# Altium project BMS_MAINBOARD.PrjPCB
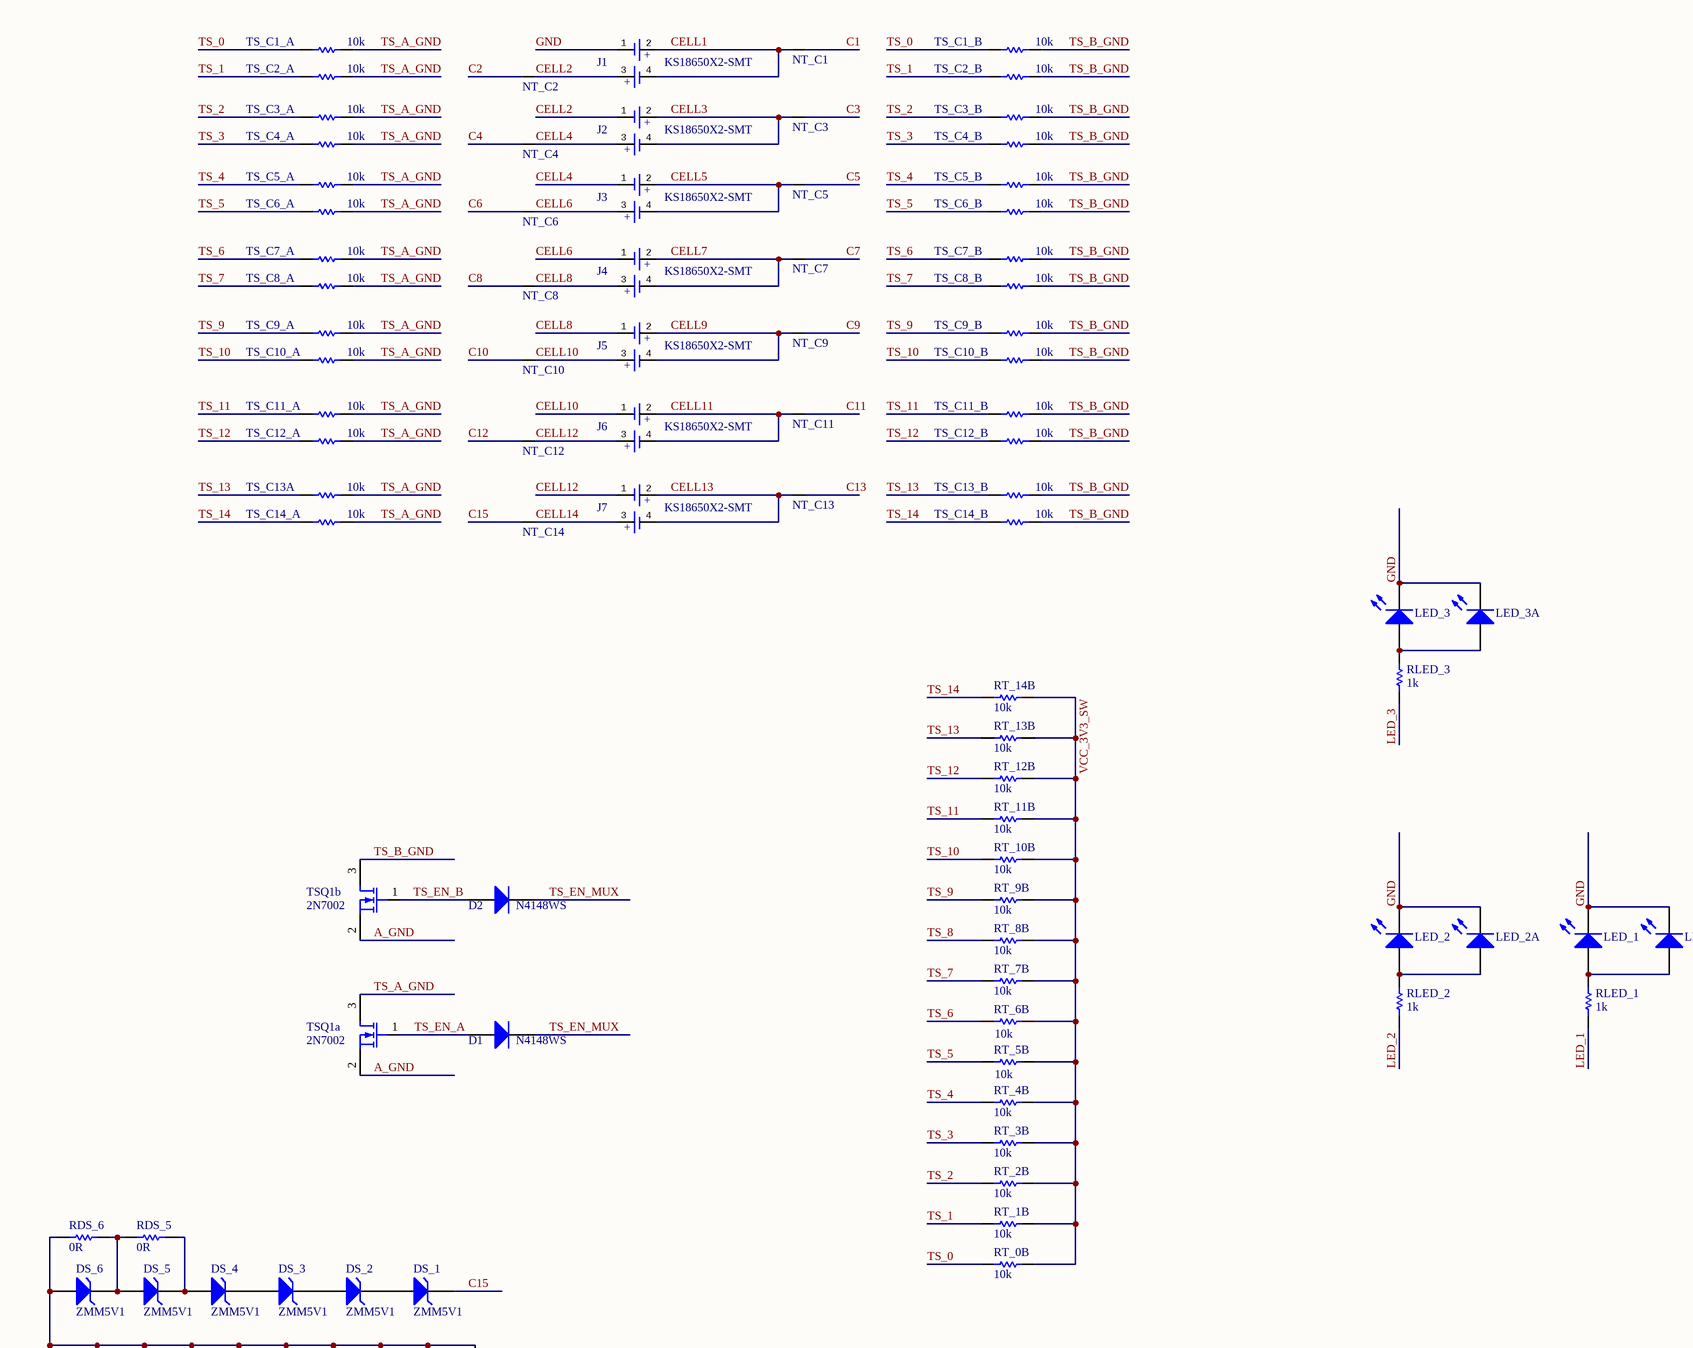
[diagram p0: BMS_MAINBOARD.SchDoc, top left]
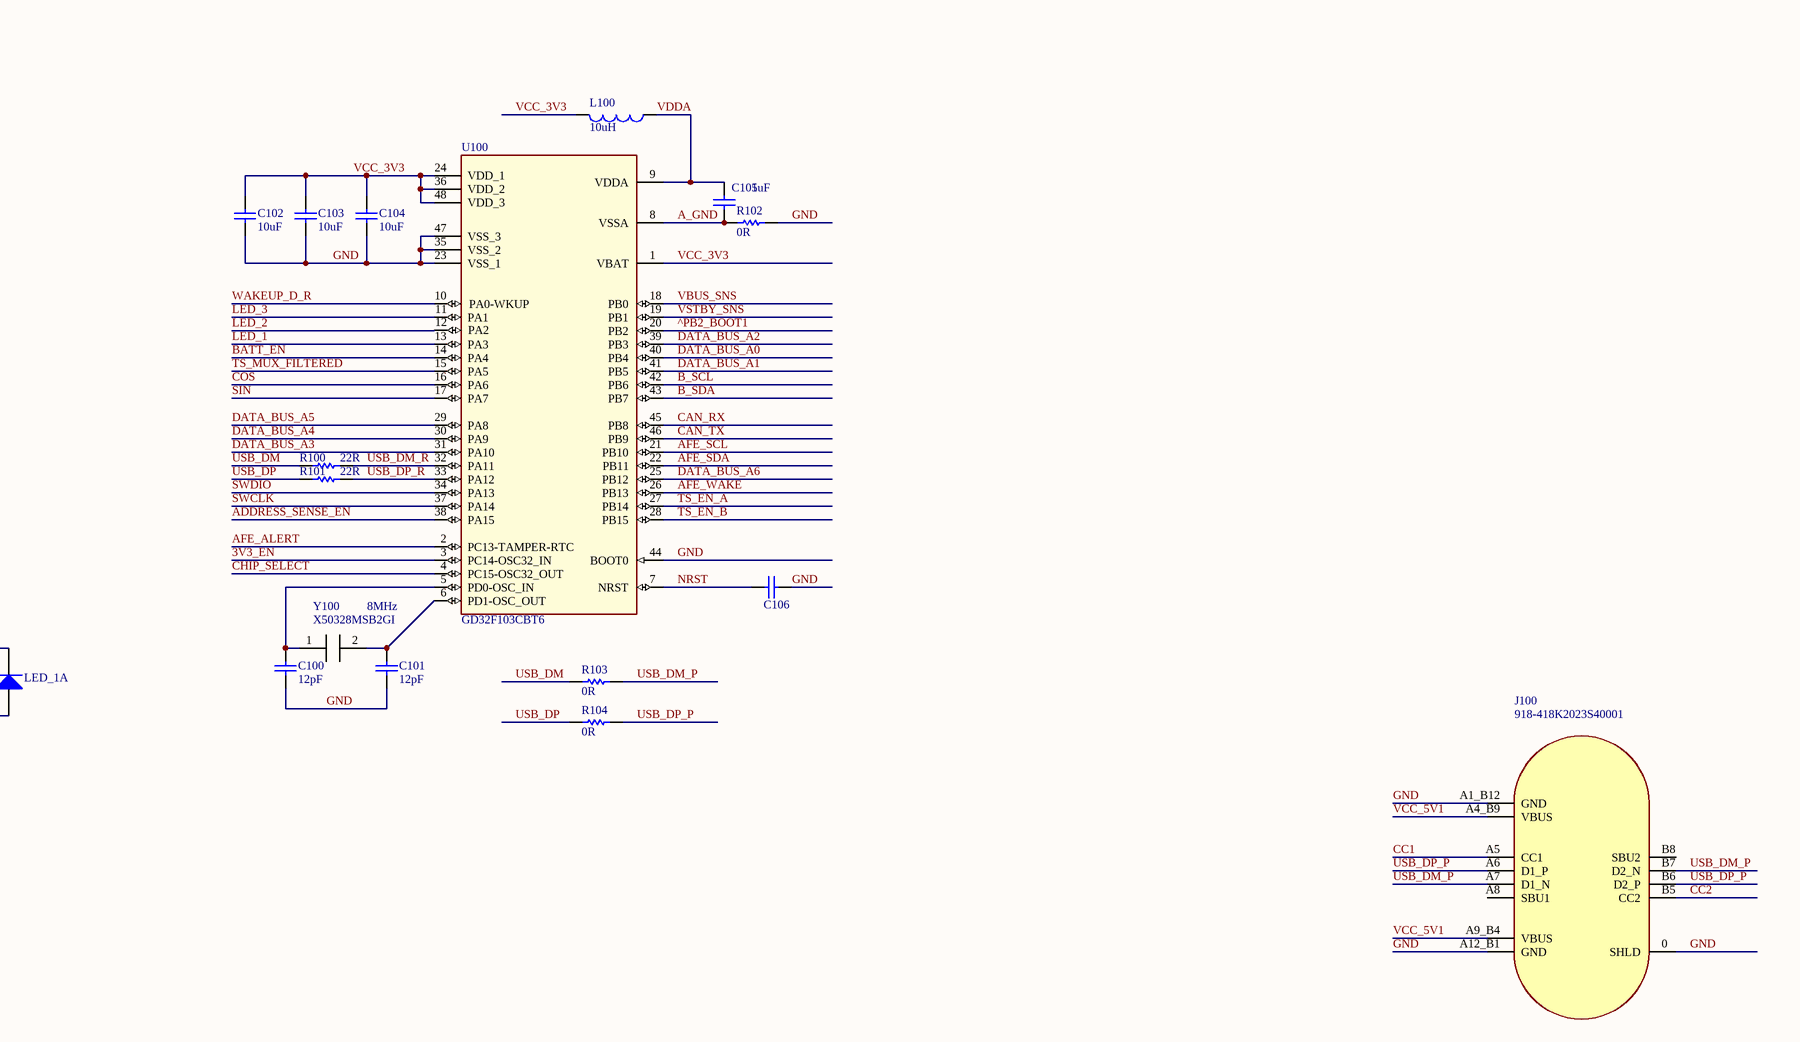
[diagram p1: BMS_MAINBOARD.SchDoc, top right]
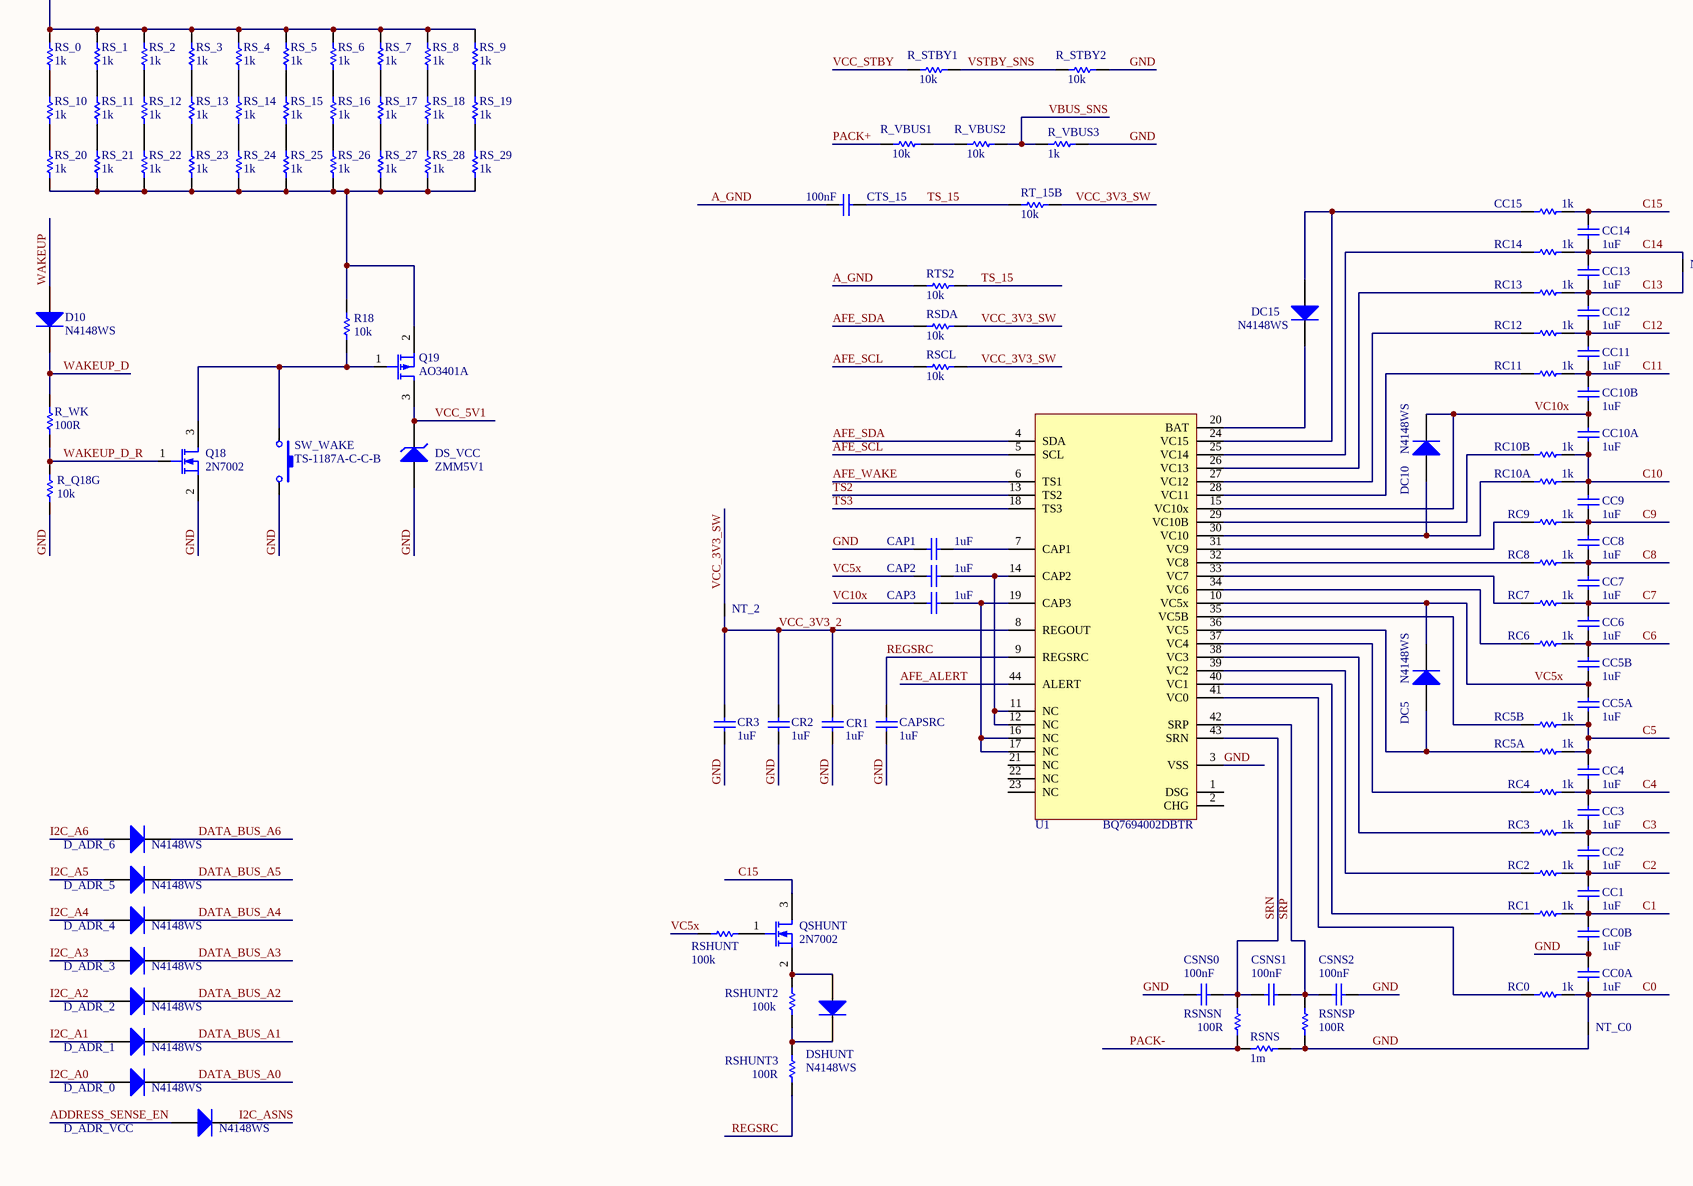
[diagram p2: BMS_MAINBOARD.SchDoc, bottom left]
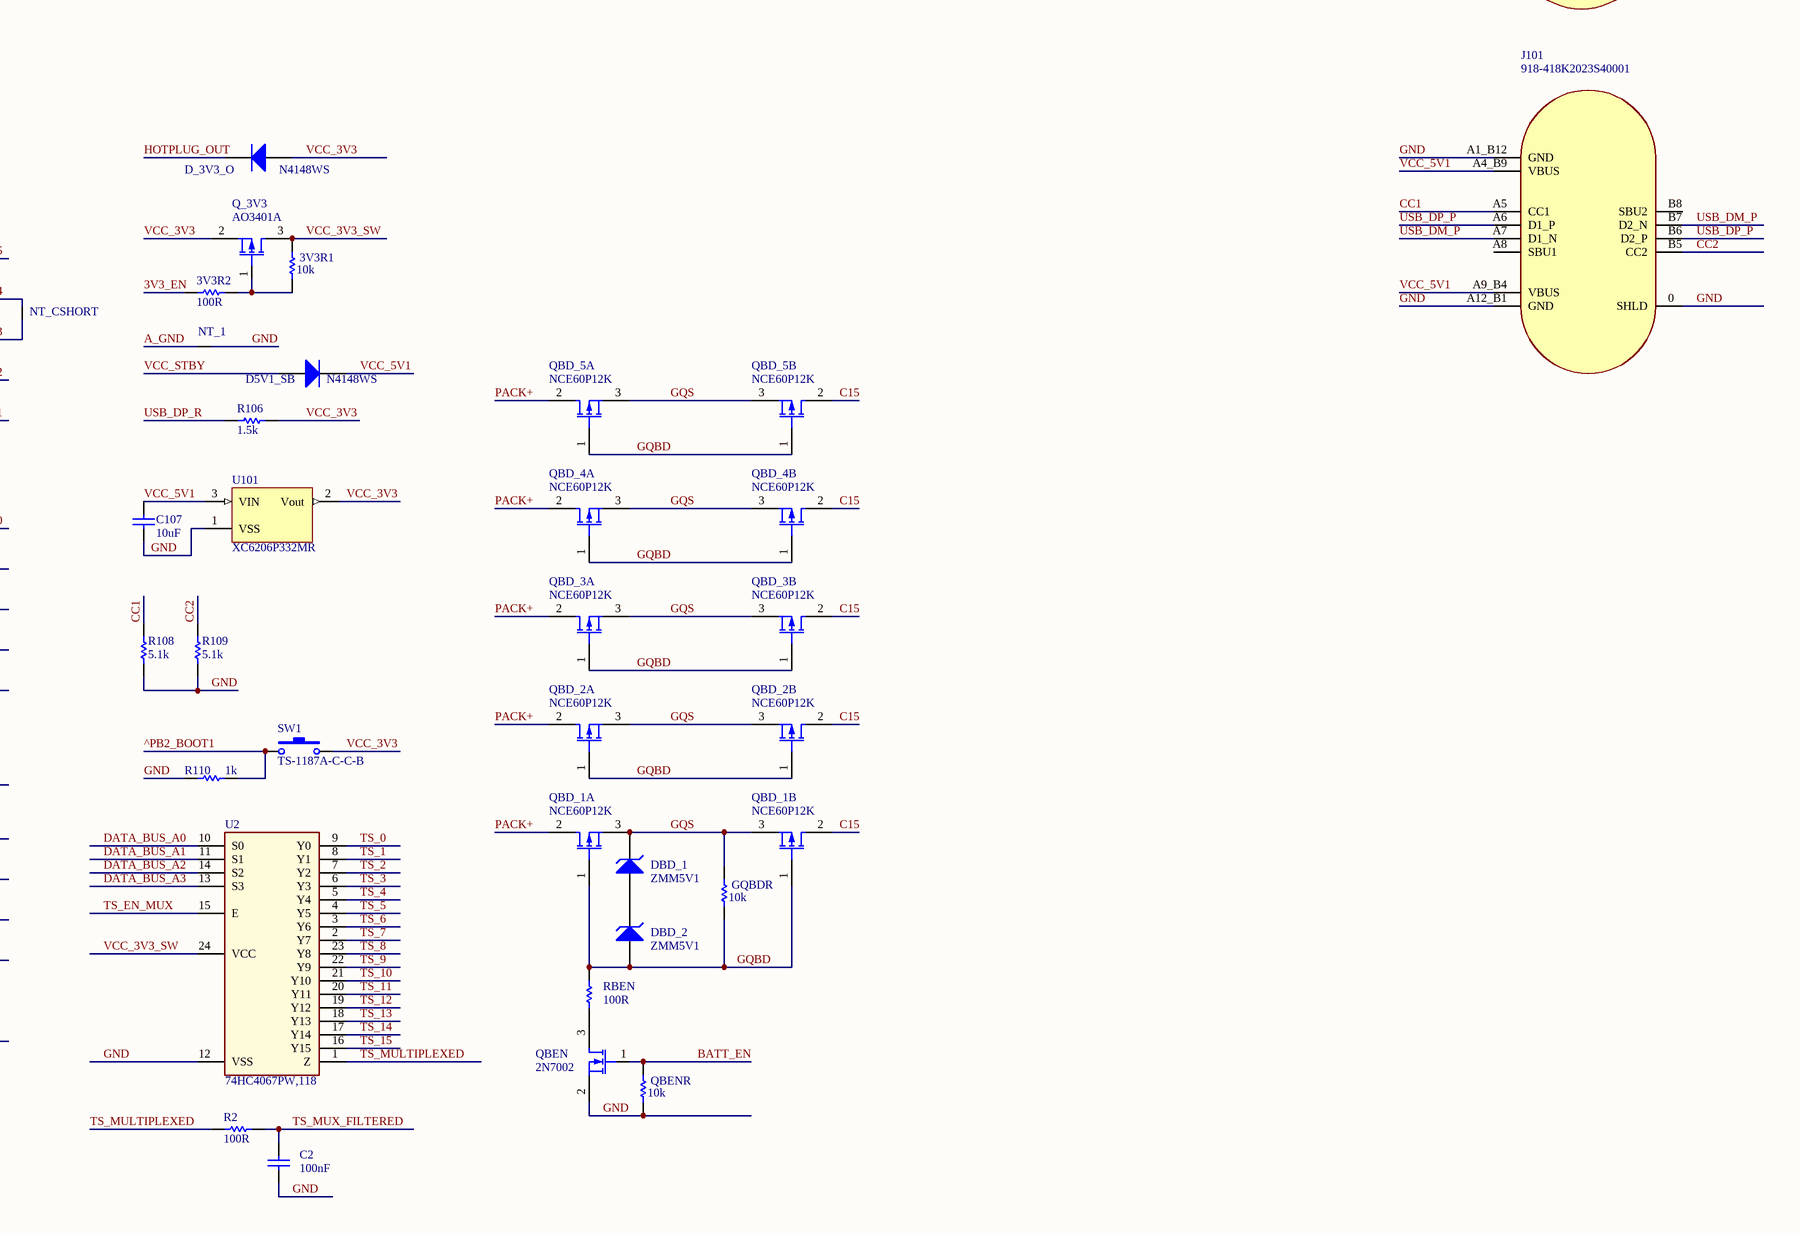
[diagram p3: BMS_MAINBOARD.SchDoc, bottom right]
1 sheet, 251 parts. Net scope: global (net labels, ports and power ports of the same name join across sheets).
Board file: BMS_MAINBOARD_2.PcbDoc

## Sheet BMS_MAINBOARD.SchDoc
size D

### Parts
3V3R1  value 10k  [R_0402]  (hidden comment: 0402WGF1002TCE)
3V3R2  value 100R  [R_0402]  (hidden comment: 0402WGF1000TCE)
C2  value 100nF  [C_0402]  (hidden comment: CL05B104KO5NNNC)
C100  value 12pF  [C_0402]  (hidden comment: 0402CG120J500NT)
C101  value 12pF  [C_0402]  (hidden comment: 0402CG120J500NT)
C102  value 10uF  [C_0402]  (hidden comment: CL05A106MQ5NUNC)
C103  value 10uF  [C_0402]  (hidden comment: CL05A106MQ5NUNC)
C104  value 10uF  [C_0402]  (hidden comment: CL05A106MQ5NUNC)
C105  value 1uF  [C_0402]  (hidden comment: CL05A105KA5NQNC)
C106  0402CG101J500NT  [C_0402]  (value not drawn)
C107  value 10uF  [C_0402]  (hidden comment: CL05A106MQ5NUNC)
CAP1  value 1uF  [C_0402]  (hidden comment: CL05A105KA5NQNC)
CAP2  value 1uF  [C_0402]  (hidden comment: CL05A105KA5NQNC)
CAP3  value 1uF  [C_0402]  (hidden comment: CL05A105KA5NQNC)
CAPSRC  value 1uF  [C_0402]  (hidden comment: CL05A105KA5NQNC)
CC0A  value 1uF  [C_0402]  (hidden comment: CL05A105KA5NQNC)
CC0B  value 1uF  [C_0402]  (hidden comment: CL05A105KA5NQNC)
CC1  value 1uF  [C_0402]  (hidden comment: CL05A105KA5NQNC)
CC2  value 1uF  [C_0402]  (hidden comment: CL05A105KA5NQNC)
CC3  value 1uF  [C_0402]  (hidden comment: CL05A105KA5NQNC)
CC4  value 1uF  [C_0402]  (hidden comment: CL05A105KA5NQNC)
CC5A  value 1uF  [C_0402]  (hidden comment: CL05A105KA5NQNC)
CC5B  value 1uF  [C_0402]  (hidden comment: CL05A105KA5NQNC)
CC6  value 1uF  [C_0402]  (hidden comment: CL05A105KA5NQNC)
CC7  value 1uF  [C_0402]  (hidden comment: CL05A105KA5NQNC)
CC8  value 1uF  [C_0402]  (hidden comment: CL05A105KA5NQNC)
CC9  value 1uF  [C_0402]  (hidden comment: CL05A105KA5NQNC)
CC10A  value 1uF  [C_0402]  (hidden comment: CL05A105KA5NQNC)
CC10B  value 1uF  [C_0402]  (hidden comment: CL05A105KA5NQNC)
CC11  value 1uF  [C_0402]  (hidden comment: CL05A105KA5NQNC)
CC12  value 1uF  [C_0402]  (hidden comment: CL05A105KA5NQNC)
CC13  value 1uF  [C_0402]  (hidden comment: CL05A105KA5NQNC)
CC14  value 1uF  [C_0402]  (hidden comment: CL05A105KA5NQNC)
CC15  value 1k  [R_0402]  (hidden comment: 0402WGF1001TCE)
CR1  value 1uF  [C_0402]  (hidden comment: CL05A105KA5NQNC)
CR2  value 1uF  [C_0402]  (hidden comment: CL05A105KA5NQNC)
CR3  value 1uF  [C_0402]  (hidden comment: CL05A105KA5NQNC)
CSNS0  value 100nF  [C_0402]  (hidden comment: CL05B104KO5NNNC)
CSNS1  value 100nF  [C_0402]  (hidden comment: CL05B104KO5NNNC)
CSNS2  value 100nF  [C_0402]  (hidden comment: CL05B104KO5NNNC)
CTS_15  value 100nF  [C_0402]  (hidden comment: CL05B104KO5NNNC)
D1  N4148WS  [SOD-323]
D2  N4148WS  [SOD-323]
D5V1_SB  N4148WS  [SOD-323]
D10  N4148WS  [SOD-323]
D_3V3_O  N4148WS  [SOD-323]
D_ADR_0  N4148WS  [SOD-323]
D_ADR_1  N4148WS  [SOD-323]
D_ADR_2  N4148WS  [SOD-323]
D_ADR_3  N4148WS  [SOD-323]
D_ADR_4  N4148WS  [SOD-323]
D_ADR_5  N4148WS  [SOD-323]
D_ADR_6  N4148WS  [SOD-323]
D_ADR_VCC  N4148WS  [SOD-323]
DBD_1  ZMM5V1  [DO-213AA]
DBD_2  ZMM5V1  [DO-213AA]
DC5  N4148WS  [SOD-323]
DC10  N4148WS  [SOD-323]
DC15  N4148WS  [SOD-323]
DS_1  ZMM5V1  [DO-213AA]
DS_2  ZMM5V1  [DO-213AA]
DS_3  ZMM5V1  [DO-213AA]
DS_4  ZMM5V1  [DO-213AA]
DS_5  ZMM5V1  [DO-213AA]
DS_6  ZMM5V1  [DO-213AA]
DS_VCC  ZMM5V1  [DO-213AA]
DSHUNT  N4148WS  [SOD-323]
GQBDR  value 10k  [R_0402]  (hidden comment: 0402WGF1002TCE)
J1  KS18650X2-SMT  [KS18650X2-SMT]
J2  KS18650X2-SMT  [KS18650X2-SMT]
J3  KS18650X2-SMT  [KS18650X2-SMT]
J4  KS18650X2-SMT  [KS18650X2-SMT]
J5  KS18650X2-SMT  [KS18650X2-SMT]
J6  KS18650X2-SMT  [KS18650X2-SMT]
J7  KS18650X2-SMT  [KS18650X2-SMT]
J100  918-418K2023S40001  [DX07S016JA1R1500]
J101  918-418K2023S40001  [DX07S016JA1R1500]
L100  value 10uH  [L_0603]  (hidden comment: SDFL1608S100KTF)
LED_1  19-21UYC/S530-A4/TR8  [D_0603]  (value not drawn)
LED_1A  19-21UYC/S530-A4/TR8  [D_0603]  (value not drawn)
LED_2  19-21UYC/S530-A4/TR8  [D_0603]  (value not drawn)
LED_2A  19-21UYC/S530-A4/TR8  [D_0603]  (value not drawn)
LED_3  19-21UYC/S530-A4/TR8  [D_0603]  (value not drawn)
LED_3A  19-21UYC/S530-A4/TR8  [D_0603]  (value not drawn)
NT_1  0  [NET_TIE]  (value not drawn)
NT_2  0  [NET_TIE]  (value not drawn)
NT_C0  0  [NET_TIE]  (value not drawn)
NT_C1  0  [NET_TIE]  (value not drawn)
NT_C2  0  [NET_TIE]  (value not drawn)
NT_C3  0  [NET_TIE]  (value not drawn)
NT_C4  0  [NET_TIE]  (value not drawn)
NT_C5  0  [NET_TIE]  (value not drawn)
NT_C6  0  [NET_TIE]  (value not drawn)
NT_C7  0  [NET_TIE]  (value not drawn)
NT_C8  0  [NET_TIE]  (value not drawn)
NT_C9  0  [NET_TIE]  (value not drawn)
NT_C10  0  [NET_TIE]  (value not drawn)
NT_C11  0  [NET_TIE]  (value not drawn)
NT_C12  0  [NET_TIE]  (value not drawn)
NT_C13  0  [NET_TIE]  (value not drawn)
NT_C14  0  [NET_TIE]  (value not drawn)
NT_CSHORT  0  [NET_TIE]  (value not drawn)
Q18  2N7002  [TO-236AB]
Q19  AO3401A  [TO-236AB]
Q_3V3  AO3401A  [TO-236AB]
QBD_1A  NCE60P12K  [TO-252AA]
QBD_1B  NCE60P12K  [TO-252AA]
QBD_2A  NCE60P12K  [TO-252AA]
QBD_2B  NCE60P12K  [TO-252AA]
QBD_3A  NCE60P12K  [TO-252AA]
QBD_3B  NCE60P12K  [TO-252AA]
QBD_4A  NCE60P12K  [TO-252AA]
QBD_4B  NCE60P12K  [TO-252AA]
QBD_5A  NCE60P12K  [TO-252AA]
QBD_5B  NCE60P12K  [TO-252AA]
QBEN  2N7002  [TO-236AB]
QBENR  value 10k  [R_0402]  (hidden comment: 0402WGF1002TCE)
QSHUNT  2N7002  [TO-236AB]
R2  value 100R  [R_0402]  (hidden comment: 0402WGF1000TCE)
R18  value 10k  [R_0402]  (hidden comment: 0402WGF1002TCE)
R100  value 22R  [R_0402]  (hidden comment: 0402WGF220JTCE)
R101  value 22R  [R_0402]  (hidden comment: 0402WGF220JTCE)
R102  value 0R  [R_0402]  (hidden comment: 0402WGF0000TCE)
R103  value 0R  [R_0402]  (hidden comment: 0402WGF0000TCE)
R104  value 0R  [R_0402]  (hidden comment: 0402WGF0000TCE)
R106  value 1.5k  [R_0402]  (hidden comment: 0402WGF1501TCE)
R108  value 5.1k  [R_0402]  (hidden comment: 0402WGF5101TCE)
R109  value 5.1k  [R_0402]  (hidden comment: 0402WGF5101TCE)
R110  value 1k  [R_0402]  (hidden comment: 0402WGF1001TCE)
R_Q18G  value 10k  [R_0402]  (hidden comment: 0402WGF1002TCE)
R_STBY1  value 10k  [R_0402]  (hidden comment: 0402WGF1002TCE)
R_STBY2  value 10k  [R_0402]  (hidden comment: 0402WGF1002TCE)
R_VBUS1  value 10k  [R_0402]  (hidden comment: 0402WGF1002TCE)
R_VBUS2  value 10k  [R_0402]  (hidden comment: 0402WGF1002TCE)
R_VBUS3  value 1k  [R_0402]  (hidden comment: 0402WGF1001TCE)
R_WK  value 100R  [R_0402]  (hidden comment: 0402WGF1000TCE)
RBEN  value 100R  [R_0402]  (hidden comment: 0402WGF1000TCE)
RC0  value 1k  [R_0402]  (hidden comment: 0402WGF1001TCE)
RC1  value 1k  [R_0402]  (hidden comment: 0402WGF1001TCE)
RC2  value 1k  [R_0402]  (hidden comment: 0402WGF1001TCE)
RC3  value 1k  [R_0402]  (hidden comment: 0402WGF1001TCE)
RC4  value 1k  [R_0402]  (hidden comment: 0402WGF1001TCE)
RC5A  value 1k  [R_0402]  (hidden comment: 0402WGF1001TCE)
RC5B  value 1k  [R_0402]  (hidden comment: 0402WGF1001TCE)
RC6  value 1k  [R_0402]  (hidden comment: 0402WGF1001TCE)
RC7  value 1k  [R_0402]  (hidden comment: 0402WGF1001TCE)
RC8  value 1k  [R_0402]  (hidden comment: 0402WGF1001TCE)
RC9  value 1k  [R_0402]  (hidden comment: 0402WGF1001TCE)
RC10A  value 1k  [R_0402]  (hidden comment: 0402WGF1001TCE)
RC10B  value 1k  [R_0402]  (hidden comment: 0402WGF1001TCE)
RC11  value 1k  [R_0402]  (hidden comment: 0402WGF1001TCE)
RC12  value 1k  [R_0402]  (hidden comment: 0402WGF1001TCE)
RC13  value 1k  [R_0402]  (hidden comment: 0402WGF1001TCE)
RC14  value 1k  [R_0402]  (hidden comment: 0402WGF1001TCE)
RDS_5  value 0R  [R_0402]  (hidden comment: 0402WGF0000TCE)
RDS_6  value 0R  [R_0402]  (hidden comment: 0402WGF0000TCE)
RLED_1  value 1k  [R_0402]  (hidden comment: 0402WGF1001TCE)
RLED_2  value 1k  [R_0402]  (hidden comment: 0402WGF1001TCE)
RLED_3  value 1k  [R_0402]  (hidden comment: 0402WGF1001TCE)
RS_0  value 1k  [R_0402]  (hidden comment: 0402WGF1001TCE)
RS_1  value 1k  [R_0402]  (hidden comment: 0402WGF1001TCE)
RS_2  value 1k  [R_0402]  (hidden comment: 0402WGF1001TCE)
RS_3  value 1k  [R_0402]  (hidden comment: 0402WGF1001TCE)
RS_4  value 1k  [R_0402]  (hidden comment: 0402WGF1001TCE)
RS_5  value 1k  [R_0402]  (hidden comment: 0402WGF1001TCE)
RS_6  value 1k  [R_0402]  (hidden comment: 0402WGF1001TCE)
RS_7  value 1k  [R_0402]  (hidden comment: 0402WGF1001TCE)
RS_8  value 1k  [R_0402]  (hidden comment: 0402WGF1001TCE)
RS_9  value 1k  [R_0402]  (hidden comment: 0402WGF1001TCE)
RS_10  value 1k  [R_0402]  (hidden comment: 0402WGF1001TCE)
RS_11  value 1k  [R_0402]  (hidden comment: 0402WGF1001TCE)
RS_12  value 1k  [R_0402]  (hidden comment: 0402WGF1001TCE)
RS_13  value 1k  [R_0402]  (hidden comment: 0402WGF1001TCE)
RS_14  value 1k  [R_0402]  (hidden comment: 0402WGF1001TCE)
RS_15  value 1k  [R_0402]  (hidden comment: 0402WGF1001TCE)
RS_16  value 1k  [R_0402]  (hidden comment: 0402WGF1001TCE)
RS_17  value 1k  [R_0402]  (hidden comment: 0402WGF1001TCE)
RS_18  value 1k  [R_0402]  (hidden comment: 0402WGF1001TCE)
RS_19  value 1k  [R_0402]  (hidden comment: 0402WGF1001TCE)
RS_20  value 1k  [R_0402]  (hidden comment: 0402WGF1001TCE)
RS_21  value 1k  [R_0402]  (hidden comment: 0402WGF1001TCE)
RS_22  value 1k  [R_0402]  (hidden comment: 0402WGF1001TCE)
RS_23  value 1k  [R_0402]  (hidden comment: 0402WGF1001TCE)
RS_24  value 1k  [R_0402]  (hidden comment: 0402WGF1001TCE)
RS_25  value 1k  [R_0402]  (hidden comment: 0402WGF1001TCE)
RS_26  value 1k  [R_0402]  (hidden comment: 0402WGF1001TCE)
RS_27  value 1k  [R_0402]  (hidden comment: 0402WGF1001TCE)
RS_28  value 1k  [R_0402]  (hidden comment: 0402WGF1001TCE)
RS_29  value 1k  [R_0402]  (hidden comment: 0402WGF1001TCE)
RSCL  value 10k  [R_0402]  (hidden comment: 0402WGF1002TCE)
RSDA  value 10k  [R_0402]  (hidden comment: 0402WGF1002TCE)
RSHUNT  value 100k  [R_0402]  (hidden comment: 0402WGF1003TCE)
RSHUNT2  value 100k  [R_0402]  (hidden comment: 0402WGF1003TCE)
RSHUNT3  value 100R  [R_0402]  (hidden comment: 0402WGF1000TCE)
RSNS  1m  [R_2512]
RSNSN  value 100R  [R_0402]  (hidden comment: 0402WGF1000TCE)
RSNSP  value 100R  [R_0402]  (hidden comment: 0402WGF1000TCE)
RT_0B  value 10k  [R_0402]  (hidden comment: 0402WGF1002TCE)
RT_1B  value 10k  [R_0402]  (hidden comment: 0402WGF1002TCE)
RT_2B  value 10k  [R_0402]  (hidden comment: 0402WGF1002TCE)
RT_3B  value 10k  [R_0402]  (hidden comment: 0402WGF1002TCE)
RT_4B  value 10k  [R_0402]  (hidden comment: 0402WGF1002TCE)
RT_5B  value 10k  [R_0402]  (hidden comment: 0402WGF1002TCE)
RT_6B  value 10k  [R_0402]  (hidden comment: 0402WGF1002TCE)
RT_7B  value 10k  [R_0402]  (hidden comment: 0402WGF1002TCE)
RT_8B  value 10k  [R_0402]  (hidden comment: 0402WGF1002TCE)
RT_9B  value 10k  [R_0402]  (hidden comment: 0402WGF1002TCE)
RT_10B  value 10k  [R_0402]  (hidden comment: 0402WGF1002TCE)
RT_11B  value 10k  [R_0402]  (hidden comment: 0402WGF1002TCE)
RT_12B  value 10k  [R_0402]  (hidden comment: 0402WGF1002TCE)
RT_13B  value 10k  [R_0402]  (hidden comment: 0402WGF1002TCE)
RT_14B  value 10k  [R_0402]  (hidden comment: 0402WGF1002TCE)
RT_15B  value 10k  [R_0402]  (hidden comment: 0402WGF1002TCE)
RTS2  value 10k  [R_0402]  (hidden comment: NCP15XH103F03RC)
SW1  TS-1187A-C-C-B  [TS-1187A-C-C-B]
SW_WAKE  TS-1187A-C-C-B  [TS-1187A-C-C-B]
TS_C1_A  value 10k  [R_0402]  (hidden comment: NCP15XH103F03RC)
TS_C1_B  value 10k  [R_0402]  (hidden comment: NCP15XH103F03RC)
TS_C2_A  value 10k  [R_0402]  (hidden comment: NCP15XH103F03RC)
TS_C2_B  value 10k  [R_0402]  (hidden comment: NCP15XH103F03RC)
TS_C3_A  value 10k  [R_0402]  (hidden comment: NCP15XH103F03RC)
TS_C3_B  value 10k  [R_0402]  (hidden comment: NCP15XH103F03RC)
TS_C4_A  value 10k  [R_0402]  (hidden comment: NCP15XH103F03RC)
TS_C4_B  value 10k  [R_0402]  (hidden comment: NCP15XH103F03RC)
TS_C5_A  value 10k  [R_0402]  (hidden comment: NCP15XH103F03RC)
TS_C5_B  value 10k  [R_0402]  (hidden comment: NCP15XH103F03RC)
TS_C6_A  value 10k  [R_0402]  (hidden comment: NCP15XH103F03RC)
TS_C6_B  value 10k  [R_0402]  (hidden comment: NCP15XH103F03RC)
TS_C7_A  value 10k  [R_0402]  (hidden comment: NCP15XH103F03RC)
TS_C7_B  value 10k  [R_0402]  (hidden comment: NCP15XH103F03RC)
TS_C8_A  value 10k  [R_0402]  (hidden comment: NCP15XH103F03RC)
TS_C8_B  value 10k  [R_0402]  (hidden comment: NCP15XH103F03RC)
TS_C9_A  value 10k  [R_0402]  (hidden comment: NCP15XH103F03RC)
TS_C9_B  value 10k  [R_0402]  (hidden comment: NCP15XH103F03RC)
TS_C10_A  value 10k  [R_0402]  (hidden comment: NCP15XH103F03RC)
TS_C10_B  value 10k  [R_0402]  (hidden comment: NCP15XH103F03RC)
TS_C11_A  value 10k  [R_0402]  (hidden comment: NCP15XH103F03RC)
TS_C11_B  value 10k  [R_0402]  (hidden comment: NCP15XH103F03RC)
TS_C12_A  value 10k  [R_0402]  (hidden comment: NCP15XH103F03RC)
TS_C12_B  value 10k  [R_0402]  (hidden comment: NCP15XH103F03RC)
TS_C13_B  value 10k  [R_0402]  (hidden comment: NCP15XH103F03RC)
TS_C13A  value 10k  [R_0402]  (hidden comment: NCP15XH103F03RC)
TS_C14_A  value 10k  [R_0402]  (hidden comment: NCP15XH103F03RC)
TS_C14_B  value 10k  [R_0402]  (hidden comment: NCP15XH103F03RC)
TSQ1a  2N7002  [TO-236AB]
TSQ1b  2N7002  [TO-236AB]
U1  BQ7694002DBTR  [TSSOP50P580X150-44N]
U2  74HC4067PW,118  [TSSOP-24-P0.65MM-W4.4MM]
U100  GD32F103CBT6  [QFP-48-P0.5MM]
U101  XC6206P332MR  [TO-236AB]
Y100  X50328MSB2GI  value 8MHz  [YSX530GA]

### Nets
3V3_EN: 3V3R2.2 U100.3(PC14-OSC32_IN)
^PB2_BOOT1: R110.1 SW1.1 U100.20(PB2)
A_GND: C105.1 CTS_15.1 NT_1.1 R102.2 RTS2.1 TSQ1a.2(S) TSQ1b.2(S) U100.8(VSSA)
ADDRESS_SENSE_EN: D_ADR_VCC.2(A) U100.38(PA15)
AFE_ALERT: U1.44(ALERT) U100.2(PC13-TAMPER-RTC)
AFE_SCL: RSCL.2 U1.5(SCL) U100.21(PB10)
AFE_SDA: RSDA.2 U1.4(SDA) U100.22(PB11)
AFE_WAKE: U1.6(TS1) U100.26(PB13)
B_SCL: U100.42(PB6)
B_SDA: U100.43(PB7)
BATT_EN: QBEN.1(G) QBENR.1 U100.14(PA4)
C0: CC0A.1 NT_C0.1 RC0.2
C1: CC0B.2 CC1.1 NT_C1.2 RC1.2
C2: CC1.2 CC2.1 NT_C2.1 RC2.2
C3: CC2.2 CC3.1 NT_C3.2 RC3.2
C4: CC3.2 CC4.1 NT_C4.1 RC4.2
C5: CC4.2 CC5A.1 NT_C5.2 RC5A.2 RC5B.2
C6: CC5B.2 CC6.1 NT_C6.1 RC6.2
C7: CC6.2 CC7.1 NT_C7.2 RC7.2
C8: CC7.2 CC8.1 NT_C8.1 RC8.2
C9: CC8.2 CC9.1 NT_C9.2 RC9.2
C10: CC9.2 CC10A.1 NT_C10.1 RC10A.2 RC10B.2
C11: CC10B.2 CC11.1 NT_C11.2 RC11.2
C12: CC11.2 CC12.1 NT_C12.1 RC12.2
C13: CC12.2 CC13.1 NT_C13.2 NT_CSHORT.2 RC13.2
C14: CC13.2 CC14.1 NT_CSHORT.1 RC14.2
C15: CC14.2 CC15.2 DS_1.1(K) NT_C14.1 QBD_1B.2(D) QBD_2B.2(D) QBD_3B.2(D) QBD_4B.2(D) QBD_5B.2(D) QSHUNT.3(D)
CAN_RX: U100.45(PB8)
CAN_TX: U100.46(PB9)
CC1: J100.A5(CC1) J101.A5(CC1) R108.2
CC2: J100.B5(CC2) J101.B5(CC2) R109.2
CELL1: J1.2 J1.4 NT_C1.1
CELL2: J1.3 J2.1 NT_C2.2
CELL3: J2.2 J2.4 NT_C3.1
CELL4: J2.3 J3.1 NT_C4.2
CELL5: J3.2 J3.4 NT_C5.1
CELL6: J3.3 J4.1 NT_C6.2
CELL7: J4.2 J4.4 NT_C7.1
CELL8: J4.3 J5.1 NT_C8.2
CELL9: J5.2 J5.4 NT_C9.1
CELL10: J5.3 J6.1 NT_C10.2
CELL11: J6.2 J6.4 NT_C11.1
CELL12: J6.3 J7.1 NT_C12.2
CELL13: J7.2 J7.4 NT_C13.1
CELL14: J7.3 NT_C14.2
CHIP_SELECT: U100.4(PC15-OSC32_OUT)
COS: U100.16(PA6)
DATA_BUS_A0: D_ADR_0.1(K) U2.10(S0) U100.40(PB4)
DATA_BUS_A1: D_ADR_1.1(K) U2.11(S1) U100.41(PB5)
DATA_BUS_A2: D_ADR_2.1(K) U2.14(S2) U100.39(PB3)
DATA_BUS_A3: D_ADR_3.1(K) U2.13(S3) U100.31(PA10)
DATA_BUS_A4: D_ADR_4.1(K) U100.30(PA9)
DATA_BUS_A5: D_ADR_5.1(K) U100.29(PA8)
DATA_BUS_A6: D_ADR_6.1(K) U100.25(PB12)
GND: C2.1 C100.1 C101.1 C102.1 C103.1 C104.1 C106.1 C107.1 CAP1.2 CAPSRC.2 CC0A.2 CC0B.1 CR1.2 CR2.2 CR3.2 CSNS0.1 CSNS2.2 DS_VCC.2(A) J1.1 J100.0(SHLD) J100.A1_B12(GND) J100.A12_B1(GND) J101.0(SHLD) J101.A1_B12(GND) J101.A12_B1(GND) LED_1.1(K) LED_1A.1(K) LED_2.1(K) LED_2A.1(K) LED_3.1(K) LED_3A.1(K) NT_1.2 NT_C0.2 Q18.2(S) QBEN.2(S) QBENR.2 R102.1 R108.1 R109.1 R110.2 R_Q18G.2 R_STBY2.1 R_VBUS3.1 RSNS.1 RSNSP.1 SW_WAKE.2 U1.3(VSS) U2.12(VSS) U100.23(VSS_1) U100.35(VSS_2) U100.44(BOOT0) U100.47(VSS_3) U101.1(VSS)
GQBD: DBD_2.2(A) GQBDR.2 QBD_1A.1(G) QBD_1B.1(G) QBD_2A.1(G) QBD_2B.1(G) QBD_3A.1(G) QBD_3B.1(G) QBD_4A.1(G) QBD_4B.1(G) QBD_5A.1(G) QBD_5B.1(G) RBEN.2
GQS: DBD_1.1(K) GQBDR.1 QBD_1A.3(S) QBD_1B.3(S) QBD_2A.3(S) QBD_2B.3(S) QBD_3A.3(S) QBD_3B.3(S) QBD_4A.3(S) QBD_4B.3(S) QBD_5A.3(S) QBD_5B.3(S)
HOTPLUG_OUT: D_3V3_O.1(K)
I2C_A0: D_ADR_0.2(A)
I2C_A1: D_ADR_1.2(A)
I2C_A2: D_ADR_2.2(A)
I2C_A3: D_ADR_3.2(A)
I2C_A4: D_ADR_4.2(A)
I2C_A5: D_ADR_5.2(A)
I2C_A6: D_ADR_6.2(A)
I2C_ASNS: D_ADR_VCC.1(K)
LED_1: RLED_1.2 U100.13(PA3)
LED_2: RLED_2.2 U100.12(PA2)
LED_3: RLED_3.2 U100.11(PA1)
NRST: C106.2 U100.7(NRST)
PACK+: QBD_1A.2(D) QBD_2A.2(D) QBD_3A.2(D) QBD_4A.2(D) QBD_5A.2(D) R_VBUS1.2
PACK-: RSNS.2 RSNSN.1
REGSRC: CAPSRC.1 RSHUNT3.1 U1.9(REGSRC)
SIN: U100.17(PA7)
SRN: CSNS0.2 CSNS1.1 RSNSN.2 U1.43(SRN)
SRP: CSNS1.2 CSNS2.1 RSNSP.2 U1.42(SRP)
SWCLK: U100.37(PA14)
SWDIO: U100.34(PA13)
TS2: U1.13(TS2)
TS3: U1.18(TS3)
TS_0: RT_0B.1 TS_C1_A.2 TS_C1_B.2 U2.9(Y0)
TS_1: RT_1B.1 TS_C2_A.2 TS_C2_B.2 U2.8(Y1)
TS_2: RT_2B.1 TS_C3_A.2 TS_C3_B.2 U2.7(Y2)
TS_3: RT_3B.1 TS_C4_A.2 TS_C4_B.2 U2.6(Y3)
TS_4: RT_4B.1 TS_C5_A.2 TS_C5_B.2 U2.5(Y4)
TS_5: RT_5B.1 TS_C6_A.2 TS_C6_B.2 U2.4(Y5)
TS_6: RT_6B.1 TS_C7_A.2 TS_C7_B.2 U2.3(Y6)
TS_7: RT_7B.1 TS_C8_A.2 TS_C8_B.2 U2.2(Y7)
TS_8: RT_8B.1 U2.23(Y8)
TS_9: RT_9B.1 TS_C9_A.2 TS_C9_B.2 U2.22(Y9)
TS_10: RT_10B.1 TS_C10_A.2 TS_C10_B.2 U2.21(Y10)
TS_11: RT_11B.1 TS_C11_A.2 TS_C11_B.2 U2.20(Y11)
TS_12: RT_12B.1 TS_C12_A.2 TS_C12_B.2 U2.19(Y12)
TS_13: RT_13B.1 TS_C13_B.2 TS_C13A.2 U2.18(Y13)
TS_14: RT_14B.1 TS_C14_A.2 TS_C14_B.2 U2.17(Y14)
TS_15: CTS_15.2 RT_15B.1 RTS2.2 U2.16(Y15)
TS_A_GND: TS_C1_A.1 TS_C2_A.1 TS_C3_A.1 TS_C4_A.1 TS_C5_A.1 TS_C6_A.1 TS_C7_A.1 TS_C8_A.1 TS_C9_A.1 TS_C10_A.1 TS_C11_A.1 TS_C12_A.1 TS_C13A.1 TS_C14_A.1 TSQ1a.3(D)
TS_B_GND: TS_C1_B.1 TS_C2_B.1 TS_C3_B.1 TS_C4_B.1 TS_C5_B.1 TS_C6_B.1 TS_C7_B.1 TS_C8_B.1 TS_C9_B.1 TS_C10_B.1 TS_C11_B.1 TS_C12_B.1 TS_C13_B.1 TS_C14_B.1 TSQ1b.3(D)
TS_EN_A: D1.2(A) TSQ1a.1(G) U100.27(PB14)
TS_EN_B: D2.2(A) TSQ1b.1(G) U100.28(PB15)
TS_EN_MUX: D1.1(K) D2.1(K) U2.15(E)
TS_MULTIPLEXED: R2.2 U2.1(Z)
TS_MUX_FILTERED: C2.2 R2.1 U100.15(PA5)
USB_DM: R100.1 R103.1
USB_DM_P: J100.A7(D1_N) J100.B7(D2_N) J101.A7(D1_N) J101.B7(D2_N) R103.2
USB_DM_R: R100.2 U100.32(PA11)
USB_DP: R101.1 R104.1
USB_DP_P: J100.A6(D1_P) J100.B6(D2_P) J101.A6(D1_P) J101.B6(D2_P) R104.2
USB_DP_R: R101.2 R106.1 U100.33(PA12)
VBUS_SNS: R_VBUS2.1 R_VBUS3.2 U100.18(PB0)
VC5x: CAP2.2 CC5A.2 CC5B.1 DC5.1(K) RSHUNT.1 U1.10(VC5x)
VC10x: CAP3.2 CC10A.2 CC10B.1 DC10.1(K) U1.15(VC10x)
VCC_3V3: C102.2 C103.2 C104.2 D_3V3_O.2(A) L100.2 Q_3V3.2(S) R106.2 SW1.2 U100.1(VBAT) U100.24(VDD_1) U100.36(VDD_2) U100.48(VDD_3) U101.2(Vout)
VCC_3V3_2: CR1.1 CR2.1 CR3.1 NT_2.2 U1.8(REGOUT)
VCC_3V3_SW: 3V3R1.1 NT_2.1 Q_3V3.3(D) RSCL.1 RSDA.1 RT_0B.2 RT_1B.2 RT_2B.2 RT_3B.2 RT_4B.2 RT_5B.2 RT_6B.2 RT_7B.2 RT_8B.2 RT_9B.2 RT_10B.2 RT_11B.2 RT_12B.2 RT_13B.2 RT_14B.2 RT_15B.2 U2.24(VCC)
VCC_5V1: C107.2 D5V1_SB.1(K) DS_VCC.1(K) J100.A4_B9(VBUS) J100.A9_B4(VBUS) J101.A4_B9(VBUS) J101.A9_B4(VBUS) Q19.3(D) U101.3(VIN)
VCC_STBY: D5V1_SB.2(A) R_STBY1.2
VDDA: C105.2 L100.1 U100.9(VDDA)
VSTBY_SNS: R_STBY1.1 R_STBY2.2 U100.19(PB1)
WAKEUP: D10.2(A)
WAKEUP_D: D10.1(K) R_WK.2
WAKEUP_D_R: Q18.1(G) R_Q18G.1 R_WK.1 U100.10(PA0-WKUP)
Net3V3R1_2: 3V3R1.2 3V3R2.1 Q_3V3.1(G)
NetC100_2: C100.2 U100.5(PD0-OSC_IN) Y100.1
NetC101_2: C101.2 U100.6(PD1-OSC_OUT) Y100.2
NetCAP1_1: CAP1.1 U1.7(CAP1)
NetCAP2_1: CAP2.1 U1.11(NC) U1.12(NC) U1.14(CAP2)
NetCAP3_1: CAP3.1 U1.16(NC) U1.17(NC) U1.19(CAP3)
NetCC15_1: CC15.1 DC15.2(A) U1.24(VC15)
NetDBD_1_2: DBD_1.2(A) DBD_2.1(K)
NetDC5_2: DC5.2(A) RC5A.1 U1.36(VC5)
NetDC10_2: DC10.2(A) RC10A.1 U1.30(VC10)
NetDC15_1: DC15.1(K) U1.20(BAT)
NetDS_1_2: DS_1.2(A) DS_2.1(K)
NetDS_2_2: DS_2.2(A) DS_3.1(K)
NetDS_3_2: DS_3.2(A) DS_4.1(K)
NetDS_4_2: DS_4.2(A) DS_5.1(K) RDS_5.1
NetDS_5_2: DS_5.2(A) DS_6.1(K) RDS_5.2 RDS_6.1
NetDS_6_2: DS_6.2(A) RDS_6.2 RS_0.2 RS_1.2 RS_2.2 RS_3.2 RS_4.2 RS_5.2 RS_6.2 RS_7.2 RS_8.2 RS_9.2
NetDSHUNT_1: DSHUNT.1(K) RSHUNT2.1 RSHUNT3.2
NetDSHUNT_2: DSHUNT.2(A) QSHUNT.2(S) RSHUNT2.2
NetLED_1_2: LED_1.2(A) LED_1A.2(A) RLED_1.1
NetLED_2_2: LED_2.2(A) LED_2A.2(A) RLED_2.1
NetLED_3_2: LED_3.2(A) LED_3A.2(A) RLED_3.1
NetQ18_3: Q18.3(D) Q19.1(G) R18.2 SW_WAKE.1
NetQ19_2: Q19.2(S) R18.1 RS_20.1 RS_21.1 RS_22.1 RS_23.1 RS_24.1 RS_25.1 RS_26.1 RS_27.1 RS_28.1 RS_29.1
NetQBEN_3: QBEN.3(D) RBEN.1
NetQSHUNT_1: QSHUNT.1(G) RSHUNT.2
NetR_VBUS1_1: R_VBUS1.1 R_VBUS2.2
NetRC0_1: RC0.1 U1.41(VC0)
NetRC1_1: RC1.1 U1.40(VC1)
NetRC2_1: RC2.1 U1.39(VC2)
NetRC3_1: RC3.1 U1.38(VC3)
NetRC4_1: RC4.1 U1.37(VC4)
NetRC5B_1: RC5B.1 U1.35(VC5B)
NetRC6_1: RC6.1 U1.34(VC6)
NetRC7_1: RC7.1 U1.33(VC7)
NetRC8_1: RC8.1 U1.32(VC8)
NetRC9_1: RC9.1 U1.31(VC9)
NetRC10B_1: RC10B.1 U1.29(VC10B)
NetRC11_1: RC11.1 U1.28(VC11)
NetRC12_1: RC12.1 U1.27(VC12)
NetRC13_1: RC13.1 U1.26(VC13)
NetRC14_1: RC14.1 U1.25(VC14)
NetRS_0_1: RS_0.1 RS_10.2
NetRS_1_1: RS_1.1 RS_11.2
NetRS_2_1: RS_2.1 RS_12.2
NetRS_3_1: RS_3.1 RS_13.2
NetRS_4_1: RS_4.1 RS_14.2
NetRS_5_1: RS_5.1 RS_15.2
NetRS_6_1: RS_6.1 RS_16.2
NetRS_7_1: RS_7.1 RS_17.2
NetRS_8_1: RS_8.1 RS_18.2
NetRS_9_1: RS_9.1 RS_19.2
NetRS_10_1: RS_10.1 RS_20.2
NetRS_11_1: RS_11.1 RS_21.2
NetRS_12_1: RS_12.1 RS_22.2
NetRS_13_1: RS_13.1 RS_23.2
NetRS_14_1: RS_14.1 RS_24.2
NetRS_15_1: RS_15.1 RS_25.2
NetRS_16_1: RS_16.1 RS_26.2
NetRS_17_1: RS_17.1 RS_27.2
NetRS_18_1: RS_18.1 RS_28.2
NetRS_19_1: RS_19.1 RS_29.2

Not connected (* = marked no-connect by the designer): J100 A8(SBU1) B8(SBU2); J101 A8(SBU1) B8(SBU2); U1 1(DSG) 2(CHG) 21(NC) 22(NC) 23(NC)

### Notes on the sheet
- (in symbol KS18650X2-SMT) +

### Library data of the parts
3V3R1 GQBDR QBENR R18 R_Q18G R_STBY1 R_STBY2 R_VBUS1 R_VBUS2 RSCL RSDA RT_0B RT_1B RT_2B RT_3B RT_4B RT_5B RT_6B RT_7B RT_8B RT_9B RT_10B RT_11B RT_12B RT_13B RT_14B RT_15B = 0402WGF1002TCE: R - RESISTOR - SMD - 10k - 1% - 0402; LCSC Part #: C25744; JLC Availability: Basic
3V3R2 R2 R_WK RBEN RSHUNT3 RSNSN RSNSP = 0402WGF1000TCE: R - RESISTOR - SMD - 100R - 1% - 0402; LCSC Part #: C25076; JLC Availability: Basic
C2 CSNS0-CSNS2 CTS_15 = CL05B104KO5NNNC: C - CAPACITOR - MLCC - 100nF - 16V - 0402; WVDC: 16; LCSC Part #: C1525; JLC Availability: Basic
C100 C101 = 0402CG120J500NT: C - CAPACITOR - MLCC - 12pF - 50V - 0402; WVDC: 50; LCSC Part #: C1547; JLC Availability: Basic
C102-C104 C107 = CL05A106MQ5NUNC: C - CAPACITOR - MLCC - 10uF - 6.3V - 0402; WVDC: 6.3; LCSC Part #: C15525; JLC Availability: Basic
C105 CAP1-CAP3 CAPSRC CC0A CC0B CC1-CC4 CC5A CC5B CC6-CC9 CC10A CC10B CC11-CC14 CR1-CR3 = CL05A105KA5NQNC: C - CAPACITOR - MLCC - 1uF - 25V - 0402; WVDC: 16; LCSC Part #: C52923; JLC Availability: Basic
C106 = 0402CG101J500NT: C - CAPACITOR - MLCC - 100pF - 50V - 0402; LCSC Part #: C1546; JLC Availability: Extended
CC15 R110 R_VBUS3 RC0-RC4 RC5A RC5B RC6-RC9 RC10A RC10B RC11-RC14 RLED_1-RLED_3 RS_0-RS_29 = 0402WGF1001TCE: R - RESISTOR - SMD - 1k - 1% - 0402; LCSC Part #: C11702; JLC Availability: Basic
D1 D2 D5V1_SB D10 D_3V3_O D_ADR_0-D_ADR_6 D_ADR_VCC DC5 DC10 DC15 DSHUNT = N4148WS: D - DIODE - FAST TRR - 100V - 150mA - 4ns; LCSC Part #: C2128; JLC Availability: Basic; PIV: 100V; If: 150mA; Trr: 4ns
DBD_1 DBD_2 DS_1-DS_6 DS_VCC = ZMM5V1: D - DIODE - ZENER - 5.1V - 500mW; LCSC Part #: C8061; JLC Availability: Extended
J1-J7 = KS18650X2-SMT: J - JACK - SMT Battery Holder 18650X2 Cells
J100 J101 = 918-418K2023S40001: J - JACK - USB - Type C - Recepticle - SMT - 90°; JLC Availability: LCSC; LCSC Part #: C167321
L100 = SDFL1608S100KTF: L - INDUCTOR - 10uH - 0603; LCSC Part #: C1035; JLC Availability: Basic
LED_1 LED_1A LED_2 LED_2A LED_3 LED_3A = 19-21UYC/S530-A4/TR8: D - LED - 0603 - Yellow (Sodium); LCSC Part #: C409441; JLC Availability: Extended
NT_1 NT_2 NT_C0-NT_C14 NT_CSHORT = NET_TIE: R - Net Tie
Q18 QBEN QSHUNT TSQ1a TSQ1b = 2N7002: Q - TRANSISTOR - MOSFET (N) - 60V - 200mW; JLC Availability: Basic; LCSC Part #: C8545
Q19 Q_3V3 = AO3401A: Q - TRANSISTOR - MOSFET (P) - 30V - 1.4A - 0.44 Ohm; JLC Availability: Basic; LCSC Part #: C15127
QBD_1A QBD_1B QBD_2A QBD_2B QBD_3A QBD_3B QBD_4A QBD_4B QBD_5A QBD_5B = NCE60P12K: Q - TRANSISTOR - MOSFET (P) - 60V - 12A - 0.1R; LCSC Part #: C326372; JLC Availability: Extended
R100 R101 = 0402WGF220JTCE: R - RESISTOR - SMD - 22R - 1% - 0402; LCSC Part #: C25092; JLC Availability: Basic
R102-R104 RDS_5 RDS_6 = 0402WGF0000TCE: R - RESISTOR - SMD - 0R - 1% - 0402; LCSC Part #: C17168; JLC Availability: Basic
R106 = 0402WGF1501TCE: R - RESISTOR - SMD - 1.5k - 1% - 0402; LCSC Part #: C25867; JLC Availability: Basic
R108 R109 = 0402WGF5101TCE: R - RESISTOR - SMD - 5.1k - 1% - 0402; LCSC Part #: C25905; JLC Availability: Basic
RSHUNT RSHUNT2 = 0402WGF1003TCE: R - RESISTOR - SMD - 100k - 1% -  0402; LCSC Part #: C25741; JLC Availability: Basic
RSNS = MRF6432(2512)LR001FTS: R - RESISTOR - SMD - 0.001R - 1% - 2512 - 2W; ComponentLink1URL: http://riedon.com/media/pdf/CSR.pdf; ComponentLink1Description: http://riedon.com/media/pdf/CSR.pdf; LCSC Part #: C76233; Power: 2W; JLC Availability: Extended
RTS2 TS_C1_A TS_C1_B TS_C2_A TS_C2_B TS_C3_A TS_C3_B TS_C4_A TS_C4_B TS_C5_A TS_C5_B TS_C6_A TS_C6_B TS_C7_A TS_C7_B TS_C8_A TS_C8_B TS_C9_A TS_C9_B TS_C10_A TS_C10_B TS_C11_A TS_C11_B TS_C12_A TS_C12_B TS_C13_B TS_C13A TS_C14_A TS_C14_B = NCP15XH103F03RC: RT - NTC THERMISTOR - 10k - 1% - 0402; Value2: 3380k; LCSC Part #: C77131; JLC Availability: Extended
SW1 SW_WAKE = TS-1187A-C-C-B: SW - SWITCH - SPST - NO - Top Actuated Surface Mount; LCSC Part #: C318889; JLC Availability: Extended
U1 = BQ7694002DBTR: 9 to 15-series cell li-ion and li-phosphate battery monitor (bq76940 family)
U2 = 74HC4067PW,118: U - IC -16 Port Analog MUX; ComponentLink1Description: Manufacturer URL; ComponentLink1URL: http://www.st.com/web/en/home.html; ComponentLink2Description: Datasheet; ComponentLink2URL: http://www.st.com/st-web-ui/static/active/en/resource/technical/document/datasheet/CD00161566.pdf; ComponentLink3Description: Package Specification; ComponentLink3URL: http://www.st.com/st-web-ui/static/active/en/resource/technical/document/datasheet/DM00058181.pdf; JLC Availability: Extended; LCSC Part #: C179326
U100 = GD32F103CBT6: U - IC - MCU, 128 KB Flash, 20 KB Internal RAM, 37 I/Os, 48-pin LQFP, -40 to 85 degC; FLASH Size (Prog) (kB): 128; I/Os (High Current): 37; Internal RAM Size (kB): 20; Operating Frequency(F) (Processor speed) (MHz): 72; ComponentLink1Description: Manufacturer URL; ComponentLink1URL: http://www.st.com/web/en/home.html; ComponentLink2Description: Datasheet; ComponentLink2URL: http://www.st.com/st-web-ui/static/active/en/resource/technical/document/datasheet/CD00161566.pdf; ComponentLink3Description: Package Specification; ComponentLink3URL: http://www.st.com/st-web-ui/static/active/en/resource/technical/document/datasheet/DM00058181.pdf; LCSC Part #: C77979; JLC Availability: Extended
U101 = XC6206P332MR: U - IC - LDO 3.3V 200mA; VOut: 3.3; LCSC Part #: C5446; JLC Availability: Basic
Y100 = X50328MSB2GI: Y - RESONATOR - 8MHZ ±10PPM - SMD-5032; Availability: Basic; LCSC Part #: C115962